# EAGLE design guitar_tuner (EAGLE 9.5.1)
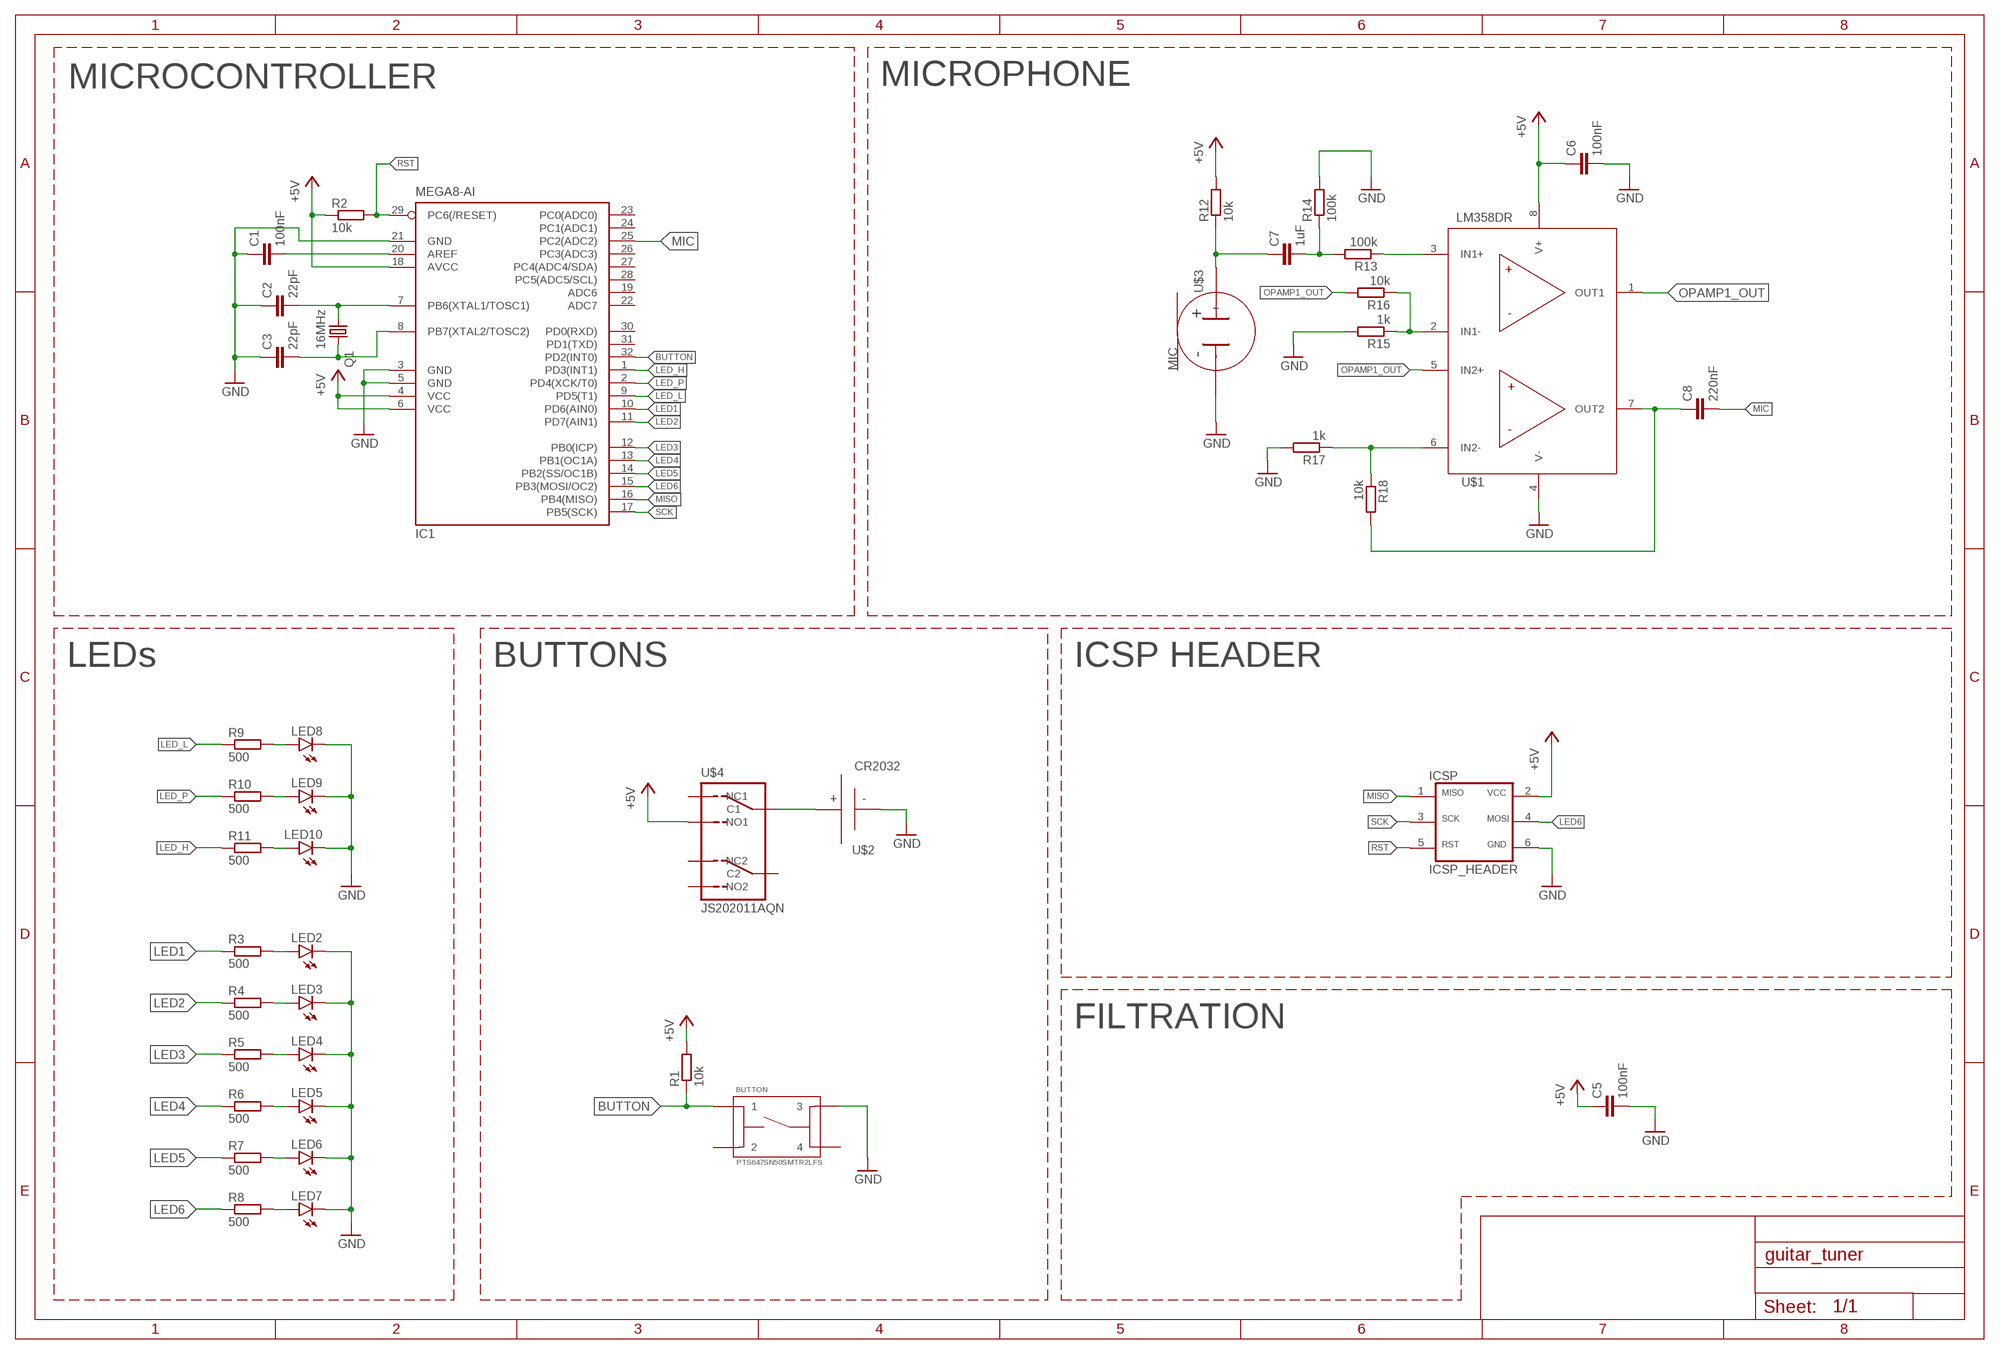
[diagram p0: schematic, sheet 1]

## Parts
BUTTON  PTS647SN50SMTR2LFS  [PTS647_SMD_TACTSWITCH]
C1  100nF  C-EUC0603  [C0603]
C2  22pF  C-EUC0603  [C0603]
C3  22pF  C-EUC0603  [C0603]
C5  100nF  C-EUC0603  [C0603]
C6  100nF  C-EUC0603  [C0603]
C7  1uF  C-EUC0603  [C0603]
C8  220nF  C-EUC0603  [C0603]
IC1  MEGA8-AI  [TQFP32-08]
LED2  LEDCHIPLED_1206  [CHIPLED_1206]
LED3  LEDCHIPLED_1206  [CHIPLED_1206]
LED4  LEDCHIPLED_1206  [CHIPLED_1206]
LED5  LEDCHIPLED_1206  [CHIPLED_1206]
LED6  LEDCHIPLED_1206  [CHIPLED_1206]
LED7  LEDCHIPLED_1206  [CHIPLED_1206]
LED8  LEDCHIPLED_1206  [CHIPLED_1206]
LED9  LEDCHIPLED_1206  [CHIPLED_1206]
LED10  LEDCHIPLED_1206  [CHIPLED_1206]
Q1  16MHz  KX-9B  [5.0X3.2_2]
R1  10k  R-EU_R0603  [R0603]
R2  10k  R-EU_R0603  [R0603]
R3  500  R-EU_R0603  [R0603]
R4  500  R-EU_R0603  [R0603]
R5  500  R-EU_R0603  [R0603]
R6  500  R-EU_R0603  [R0603]
R7  500  R-EU_R0603  [R0603]
R8  500  R-EU_R0603  [R0603]
R9  500  R-EU_R0603  [R0603]
R10  500  R-EU_R0603  [R0603]
R11  500  R-EU_R0603  [R0603]
R12  10k  R-EU_R0603  [R0603]
R13  100k  R-EU_R0603  [R0603]
R14  100k  R-EU_R0603  [R0603]
R15  1k  R-EU_R0603  [R0603]
R16  10k  R-EU_R0603  [R0603]
R17  1k  R-EU_R0603  [R0603]
R18  10k  R-EU_R0603  [R0603]
U$1  LM358DRLM358DR_SOIC8  [SOIC127P599X175-8N]
U$2  BAT-HLD-001-THM  [BAT-HLD-001-THM]
U$3  CMA-6542PF  [9.7MM_ELECTRET_MICROPHONE]
U$4  JS202011AQN  [JS202011AQN_DPDT]
U$6  ICSP_HEADER  [ICSP_HEADER]

## Nets
+5V: C5.1 C6.1 IC1.4(VCC) IC1.6(VCC) IC1.18(AVCC) R1.2 R2.1 R12.2 U$1.8(V+) U$4.P$2(NO1) U$6.2(VCC)
BUTTON: BUTTON.P$1 IC1.32(PD2(INT0)) R1.1
GND: BUTTON.P$2 C1.1 C2.1 C3.1 C5.2 C6.2 IC1.3(GND) IC1.5(GND) IC1.21(GND) LED2.C LED3.C LED4.C LED5.C LED6.C LED7.C LED8.C LED9.C LED10.C R14.2 R15.2 R17.2 U$1.4(V-) U$2.P$6(GND) U$3.P$2(-) U$6.6(GND)
LED1: IC1.10(PD6(AIN0)) R3.1
LED2: IC1.11(PD7(AIN1)) R4.1
LED3: IC1.12(PB0(ICP)) R5.1
LED4: IC1.13(PB1(OC1A)) R6.1
LED5: IC1.14(PB2(SS/OC1B)) R7.1
LED6: IC1.15(PB3(MOSI/OC2)) R8.1 U$6.4(MOSI)
LED_H: IC1.1(PD3(INT1)) R11.1
LED_L: IC1.9(PD5(T1)) R9.1
LED_P: IC1.2(PD4(XCK/T0)) R10.1
MIC: C8.2 IC1.25(PC2(ADC2))
MISO: IC1.16(PB4(MISO)) U$6.1(MISO)
N$1: C2.2 IC1.7(PB6(XTAL1/TOSC1)) Q1.1
N$2: C3.2 IC1.8(PB7(XTAL2/TOSC2)) Q1.2
N$4: C1.2 IC1.20(AREF)
N$5: U$2.P$1(5V) U$2.P$2(5V) U$2.P$3(5V) U$2.P$4(5V) U$2.P$5(5V) U$4.P$3(C1)
N$6: C7.1 R12.1 U$3.P$1(+)
N$7: LED2.A R3.2
N$8: LED3.A R4.2
N$9: LED4.A R5.2
N$10: LED5.A R6.2
N$11: LED6.A R7.2
N$12: LED7.A R8.2
N$13: LED9.A R10.2
N$14: LED8.A R9.2
N$15: LED10.A R11.2
N$16: C7.2 R13.2 R14.1
N$17: R13.1 U$1.3(IN1+)
N$18: R15.1 R16.1 U$1.2(IN1-)
N$19: R17.1 R18.1 U$1.6(IN2-)
N$20: C8.1 R18.2 U$1.7(OUT2)
OPAMP1_OUT: R16.2 U$1.1(OUT1) U$1.5(IN2+)
RST: IC1.29(PC6(/RESET)) R2.2 U$6.5(RST)
SCK: IC1.17(PB5(SCK)) U$6.3(SCK)
Unconnected: BUTTON.P$3 BUTTON.P$4 IC1.19(ADC6) IC1.22(ADC7) IC1.23(PC0(ADC0)) IC1.24(PC1(ADC1)) IC1.26(PC3(ADC3)) IC1.27(PC4(ADC4/SDA)) IC1.28(PC5(ADC5/SCL)) IC1.30(PD0(RXD)) IC1.31(PD1(TXD)) U$4.P$1(NO2) U$4.P$4(C2) U$4.P$5(NC2) U$4.P$6(NC1)

## Notes on the sheet
- MICROCONTROLLER | MICROPHONE
- LEDs | BUTTONS | ICSP HEADER
- FILTRATION

## Library data of the parts
BUTTON = NikodemBartnik:PTS647SN50SMTR2LFS: Tactile Switches 50mA 12VDC, 1.0N 5.0mm H, G leads 4.5x4.5mm
C1-C3 C5-C8 = rcl:C-EU: CAPACITOR, European symbol; SPICEPREFIX: C
IC1 = atmel:MEGA8: MICROCONTROLLER 8 Kbytes FLASH, 1 kbytes SRAM, 512 bytes EEPROM, USART, 6-channel 10 bit ADC, 2-channel 8 bit ADC Pin compatible with Atmega48, ATMega88, ATMega168 Source: avr.lbr; MPN: ATMEGA8-16AU; OC_FARNELL: 9171371; OC_NEWARK: 73M8863
LED2-LED10 = led:LED: LED OSRAM: - CHIPLED LG R971, LG N971, LY N971, LG Q971, LY Q971, LO R971, LY R971 LH N974, LH R974 LS Q976, LO Q976, LY Q976 LO Q996 - Hyper CHIPLED LW Q18S LB Q993, LB Q99A, LB R99A - SideLED LS A670, LO A670, LY A670, LG A670, LP A670 LB A673, LV A673, LT A673, LW A673 LH A674 LY A675 LS A676, LA A676, LO A676, LY A676, LW A676 LS A679, LY A679, LG A679 - Hyper Micro SIDELED® LS Y876, LA Y876, LO Y876, LY Y876 LT Y87S - SmartLED LW L88C, LW L88S LB L89C, LB L89S, LG L890 LS L89K, LO L89K, LY L89K LS L896, LA L896, LO L896, LY L896 - TOPLED LS T670, LO T670, LY T670, LG T670, LP T670 LSG T670, LSP T670, LSY T670, LOP T670, LYG T670 LG T671, LOG T671, LSG T671 LB T673, LV T673, LT T673, LW T673 LH T674 LS T676, LA T676, LO T676, LY T676, LB T676, LH T676, LSB T676, LW T676 LB T67C, LV T67C, LT T67C, LS T67K, LO T67K, LY T67K, LW E67C LS E67B, LA E67B, LO E67B, LY E67B, LB E67C, LV E67C, LT E67C LW T67C LS T679, LY T679, LG T679 LS T770, LO T770, LY T770, LG T770, LP T770 LB T773, LV T773, LT T773, LW T773 LH T774 LS E675, LA E675, LY E675, LS T675 LS T776, LA T776, LO T776, LY T776, LB T776 LHGB T686 LT T68C, LB T68C - Hyper Mini TOPLED® LB M676 - Mini TOPLED Santana® LG M470 LS M47K, LO M47K, LY M47K Source: http://www.osram.convergy.de LUXEON: - LUMILED® LXK2-PW12-R00, LXK2-PW12-S00, LXK2-PW14-U00, LXK2-PW14-V00 LXK2-PM12-R00, LXK2-PM12-S00, LXK2-PM14-U00 LXK2-PE12-Q00, LXK2-PE12-R00, LXK2-PE12-S00, LXK2-PE14-T00, LXK2-PE14-U00 LXK2-PB12-K00, LXK2-PB12-L00, LXK2-PB12-M00, LXK2-PB14-N00, LXK2-PB14-P00, LXK2-PB14-Q00 LXK2-PR12-L00, LXK2-PR12-M00, LXK2-PR14-Q00, LXK2-PR14-R00 LXK2-PD12-Q00, LXK2-PD12-R00, LXK2-PD12-S00 LXK2-PH12-R00, LXK2-PH12-S00 LXK2-PL12-P00, LXK2-PL12-Q00, LXK2-PL12-R00 Source: www.luxeon.com KINGBRIGHT: KA-3528ASYC Source: www.kingbright.com
Q1 = crystal-geyer_V1_0:KX: Quartz Crystals (MHz) SMD: KX - Serie Model Size l/w/h [mm] Frequency Range Frequency Stability Temp. Range [°C] Load Capacitance AECQ 200 availabel Datasheet KX-4 KX-5 KX-6 KX-7 KX-9A KX-9B KX-12A KX-12B KX-13 KX-20 KX-K KX-KS 1.6/1.2/0.3 2.0/1.6/0.45 2.5/2.0/0.55 3.2/2.5/0.8 5.0/3.2/1.0 5.0/3.2/1.1 6.0/3.5/1.1 6.0/3.5/1.0 7.0/5.0 /1.3 11.6/5.5/1.6 12.3/4.5/4.2 12.3/4.5/3.2 24.0 ~ 80.0 MHz 16.0 ~ 80.0 MHz 12.0 ~ 80.0 MHz 8.0 ~ 60.0 MHz 7,68 ~ 300,0 MHz 8,0 ~ 50,0 MHz 8,0 ~ 150,0 MHz 8,0 ~ 50,0 MHz 6,0 ~ 160,0 MHz 3,579 ~ 25,0 MHz 3,579 ~ 70,0 MHz 3,579 ~ 70,0 MHz ±10 … ±50ppm ±10 … ±50ppm ±10 … ±50ppm ±10 … ±50ppm ±10 … ±50ppm ±10 … ±50ppm ±10 … ±50ppm ±10 … ±50ppm ±10 … ±50ppm ±50ppm ±10 … ±50ppm ±10 … ±50ppm (*) -40°C …+85°C (*) -40°C …+125°C (*) -40°C …+125°C (*) -40°C …+125°C (*) -40°C …+105°C (*) -40°C …+105°C (*) -40°C …+125°C (*) -40°C …+105°C (*) -40°C …+105°C (*) -40°C …+105°C (*) -40°C …+85°C (*) -40°C …+85°C 8, 8…16 8, 8…16 10, 8…16 12, 7…20 16, 10…20 16, 10…20 16, 10…20 16, 12…20 16, 12…20 16, 12…20 16, 12…30 16, 12…30 - yes yes yes - - - - - - - - KX-4.pdf <http://www.geyer-electronic.de/uploads/tx_userartikelfrequenz/GEYER-KX-4.pdf> KX-5.pdf <http://www.geyer-electronic.de/uploads/tx_userartikelfrequenz/GEYER-KX-5.pdf> KX-6.pdf <http://www.geyer-electronic.de/uploads/tx_userartikelfrequenz/GEYER-KX-6.pdf> KX-7.pdf <http://www.geyer-electronic.de/uploads/tx_userartikelfrequenz/GEYER-KX-7.pdf> KX-9A.pdf <http://www.geyer-electronic.de/uploads/tx_userartikelfrequenz/GEYER-KX-9A.pdf> KX-9B.pdf <http://www.geyer-electronic.de/uploads/tx_userartikelfrequenz/GEYER-KX-9B.pdf> KX-12A.pdf <http://www.geyer-electronic.de/uploads/tx_userartikelfrequenz/GEYER-KX-12A.pdf> KX-12B.pdf <http://www.geyer-electronic.de/uploads/tx_userartikelfrequenz/GEYER-KX-12B.pdf> KX-13.pdf <http://www.geyer-electronic.de/uploads/tx_userartikelfrequenz/GEYER-KX-13.pdf> KX-20.pdf <http://www.geyer-electronic.de/uploads/tx_userartikelfrequenz/GEYER-KX-20.pdf> KX-K.pdf <http://www.geyer-electronic.de/uploads/tx_userartikelfrequenz/GEYER-KX-K.pdf> KX-KS.pdf <http://www.geyer-electronic.de/uploads/tx_userartikelfrequenz/GEYER-KX-KS.pdf> <http://www.geyer-electronic.de/fileadmin/template/img/logo-geyer-electronic.png> Details see: http://www.geyer-electronic.de/Frequenz-Produkte.9.0.html Created 2016-06-07, Hans Locher 2016 (C) Geyer Quartz Technology KX4,KX5,KX6,KX7,KX9A,KX9B,KX12A,KX12B,KX13,KX20,KXK,KXKS;1612;2016;2520;3225;5032;6035;7050;11655;12345;1,6x1,2;2,0x1,6;2,5x2,0;3,2x2,5;5,0x3,2;6,0x3,5;7,0x5,0;11,6x5,5;12,3x4,5;12,3x4,5;1.6x1.2;2.0x1.6;2.5x2.0;3.2x2.5;5.0x3.2;6.0x3.5;7.0x5.0;11.6x5.5;12.3x4.5;12.3x4.5;
R1-R18 = rcl:R-EU_: RESISTOR, European symbol; SPICEPREFIX: R
U$1 = NikodemBartnik:LM358DR
U$2 = NikodemBartnik:BAT-HLD-001-THM: Coin Cell Battery Holders Bat Hld CR2032/2025 Through-hole Mount
U$3 = NikodemBartnik:CMA-6542PF: Electret microphone CMA-6542PF 4.5V 500uA -42db 2.2Ohm 9.7mm x 6.5mm
U$4 = NikodemBartnik:JS202011AQN: Slide Switches DPDT THRU HOLE .3A R/A ON- ON 300mA 6VDC Angle
U$6 = NikodemBartnik:ICSP_HEADER

## Board
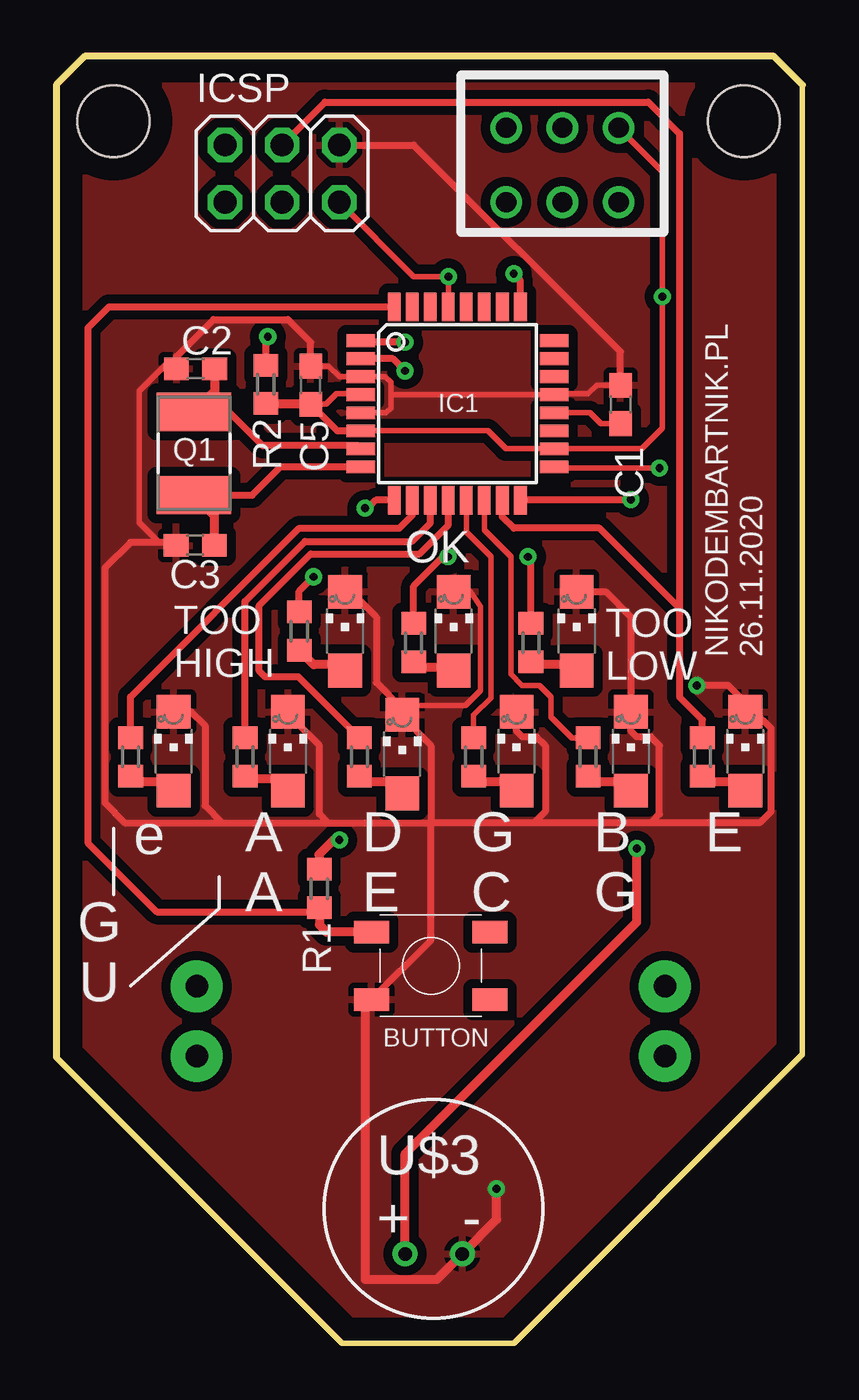
[diagram p1: board, top side]
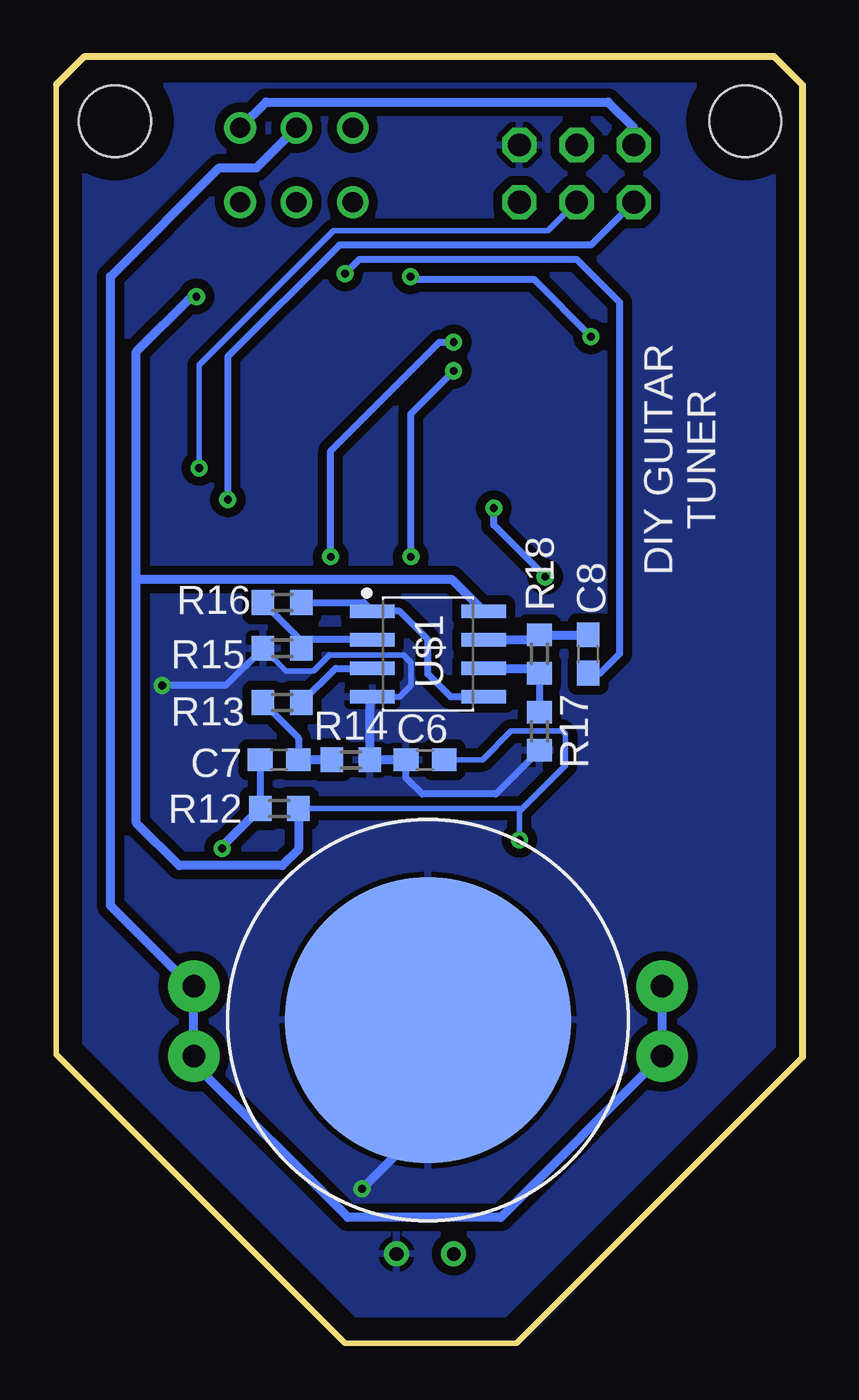
[diagram p2: board, bottom side, seen from below]

Size 33.15 x 57.15 mm. Coordinates in mm from the lower left corner, seen from the top.
Outline: 0,55.88 0,12.7 12.7,0 20.32,0 33.15,12.83 33.15,55.88 31.88,57.15 1.27,57.15 0,55.88
Copper layers (1*16): Top 0.035mm / dielectric 1.5mm / Bottom 0.035mm
Design rules "default": minimum track width 6mil, minimum drill 0.35mm, track to track 6mil, track to pad 6mil, pad to pad 6mil, via to via 6mil, smd to smd 6mil, copper to edge 40mil, drill to drill 6mil, minimum pad ring 10mil, minimum via ring 8mil, stop-mask expansion 4mil, vias tented up to drill 0mil, thermal gap 10mil
Holes 3.2 mm at 30.54,54.27 2.54,54.27

### Footprints (pad centres in the part's own frame; a part is rotated, then mirrored left to right if it is on the bottom)
PTS647_SMD_TACTSWITCH = smd 1.55 x 1: P$1 -2.625,1.5; P$2 -2.625,-1.5; P$3 2.625,1.5; P$4 2.625,-1.5
C0603 = smd 1.1 x 1: 1 -0.85,0; 2 0.85,0
TQFP32-08 = smd 1.27 x 0.559: 1 -4.293,2.8; 2 -4.293,2; 3 -4.293,1.2; 4 -4.293,0.4; 5 -4.293,-0.4; 6 -4.293,-1.2; 7 -4.293,-2; 8 -4.293,-2.8; 17 4.293,-2.8; 18 4.293,-2; 19 4.293,-1.2; 20 4.293,-0.4; 21 4.293,0.4; 22 4.293,1.2; 23 4.293,2; 24 4.293,2.8 | smd 0.559 x 1.27: 9 -2.8,-4.293; 10 -2,-4.293; 11 -1.2,-4.293; 12 -0.4,-4.293; 13 0.4,-4.293; 14 1.2,-4.293; 15 2,-4.293; 16 2.8,-4.293; 25 2.8,4.293; 26 2,4.293; 27 1.2,4.293; 28 0.4,4.293; 29 -0.4,4.293; 30 -1.2,4.293; 31 -2,4.293; 32 -2.8,4.293
CHIPLED_1206 = smd 1.5 x 1.5: A 0,-1.75; C 0,1.75
5.0X3.2_2 = smd 1.7 x 3.3: 1 -1.85,0; 2 1.85,0
R0603 = smd 1 x 1.1: 1 -0.85,0; 2 0.85,0
SOIC127P599X175-8N = smd 1.967 x 0.599: 1 -2.469,1.905; 2 -2.469,0.635; 3 -2.469,-0.635; 4 -2.469,-1.905; 5 2.469,-1.905; 6 2.469,-0.635; 7 2.469,0.635; 8 2.469,1.905
BAT-HLD-001-THM = drill 1 pad 2.3: P$1 10.4,1.5; P$2 10.4,1.5; P$3 10.4,-1.6; P$4 -10.4,1.5; P$5 -10.4,-1.6 | smd 12.7 x 12.7: P$6 0,0
9.7MM_ELECTRET_MICROPHONE = drill 0.6 pad 1: P$1 -1.27,-2; P$2 1.27,-2
JS202011AQN_DPDT = drill 0.9: P$1 2.5,-1.65; P$2 2.5,1.65; P$3 0,1.65; P$4 0,-1.65; P$5 -2.5,-1.65; P$6 -2.5,1.65
ICSP_HEADER = drill 1.016 octagon: 1 -2.54,-1.27; 2 -2.54,1.27; 3 0,-1.27; 4 0,1.27; 5 2.54,-1.27; 6 2.54,1.27

### Placement (x,y rotation side)
BUTTON  16.64,16.76 0 top
C1  25.06,41.69 270 top
C2  6.19,43.27 0 top
C3  6.17,35.43 0 top
C5  11.3,42.54 90 top
C6  16.76,25.91 180 bottom
C7  23.24,25.91 0 bottom
C8  9.53,30.61 270 bottom
IC1  17.82,41.72 0 top
LED2  5.21,26.29 0 top
LED3  10.29,26.29 0 top
LED4  15.37,26.16 0 top
LED5  20.45,26.29 0 top
LED6  25.53,26.29 0 top
LED7  30.61,26.29 0 top
LED8  12.83,31.62 0 top
LED9  17.65,31.62 0 top
LED10  23.11,31.62 0 top
Q1  6.12,39.51 270 top
R1  11.68,20.19 90 top
R2  9.31,42.58 90 top
R3  3.3,26.04 270 top
R4  8.38,26.04 270 top
R5  13.46,26.04 270 top
R6  18.54,26.04 270 top
R7  23.62,26.04 270 top
R8  28.7,26.04 270 top
R9  10.79,31.62 270 top
R10  15.88,31.11 270 top
R11  21.08,31.11 270 top
R12  23.24,23.75 0 bottom
R13  23.11,28.45 180 bottom
R14  20.07,25.91 0 bottom
R15  23.11,30.86 180 bottom
R16  23.11,32.89 0 bottom
R17  11.68,27.18 270 bottom
R18  11.68,30.61 90 bottom
U$1  16.64,30.61 0 bottom
U$2  16.64,14.35 0 bottom
U$3  16.76,5.97 0 top
U$4  22.48,52.32 0 top
U$6  10.03,51.94 0 top

### Tracks (layer width: path | path; a pad name or v marks a point on that pad's centre or on a via)
+5V  (via drill 0.35)
  Top 0.254: C5.1 11.98,41.7 12.45,42.16 13.48,42.16 IC1.4 | R2.1 9.35,41.7 | IC1.6 19.17,40.52 19.97,39.72 IC1.18 26.01,39.72 26.92,40.64 v26.92,46.48 26.92,52.03 U$4.P$2
  Top 0.305: C5.1 12.47,40.52 IC1.6
  Top 0.406: C5.1 9.35,41.7 | R1.2 11.66,21.06 11.66,21.7 12.32,22.35 v12.57,22.35
  Bottom 0.254: C6.1 14.22,25.91 12.95,27.18 10.67,27.18 10.54,27.05 10.54,25.65 12.45,23.75 | 12.45,23.75 12.57,23.62 v12.57,22.35 | 12.45,23.75 R12.2
  Bottom 0.406: U$6.2 7.49,53.97 8.64,55.12 23.84,55.12 U$4.P$2 | R12.2 22.39,21.93 23.11,21.21 27.69,21.21 29.59,23.11 29.59,33.91 | 29.59,33.91 29.59,44.03 27.14,46.48 v26.92,46.48 | U$1.8 15.56,33.91 29.59,33.91
BUTTON
  Top 0.254: 11.37,19.15 11.56,19.34 R1.1
  Top 0.305: IC1.32 2.33,46.02 1.4,45.08 1.4,22.23 4.47,19.15 11.37,19.15
  Top 0.406: BUTTON.P$1 12,18.26 11.68,18.58 R1.1
GND  (via drill 0.35)
  Top 0.254: C5.2 12.1,43.39 12.57,42.92 IC1.3 14.61,42.92 14.86,42.67 14.86,42.16 | C1.1 24,42.54 23.62,42.16 22.15,42.16 IC1.21 14.9,42.12 14.86,42.16 | 14.86,42.16 14.86,41.53 14.65,41.32 IC1.5 | C3.1 5.19,35.56 4.57,35.56 3.68,36.45 3.68,42.29 4.83,43.43 5.17,43.43 C2.1 | LED9.C 18.41,33.37 18.85,32.72 18.85,28.99 18.18,28.32 15.78,28.32
  Top 0.305: LED8.C 13.1,33.37 14.22,32.25 14.22,29.34 15.37,28.19 LED4.C | 7.37,23.11 6.6,23.88 6.6,27.43 6,28.04 LED2.C | LED3.C 10.73,27.49 11.68,26.54 11.68,23.5 12.06,23.11 | 7.37,23.11 12.06,23.11 | LED4.C 15.37,27.86 16.64,26.54 16.64,23.11 | 21.21,23.11 21.72,23.62 21.72,26.54 21.34,26.92 20.7,26.92 20.45,27.18 LED5.C | 21.21,23.11 16.64,23.11 | 26.42,23.11 26.8,23.5 26.8,26.54 26.42,26.92 25.78,26.92 25.53,27.18 LED6.C 25.53,32.26 24.41,33.37 LED10.C | 26.42,23.11 21.21,23.11 | 26.42,23.11 31.24,23.11 31.75,23.62 31.75,27.3 31.02,28.04 LED7.C 30.61,28.45 29.84,29.21 v28.45,29.21 | LED4.C 15.78,28.32 | C2.1 5.34,43.82 6.99,45.47 10.29,45.47 11.3,44.45 C5.2 | C1.1 25.06,44.02 15.88,53.21 U$6.6 | BUTTON.P$2 16.64,17.89 16.64,23.11 | 5.19,35.56 3.3,35.56 2.16,34.42 2.16,24 3.05,23.11 7.37,23.11 | 12.06,23.11 16.64,23.11
  Top 0.406: BUTTON.P$2 13.72,14.97 13.72,2.83 16.89,2.83 U$3.P$2 19.56,5.49 v19.56,6.86
  Bottom 0.254: R15.2 22.95,29.84 21.72,29.84 21.01,30.55 17.72,30.55 17.4,30.23 17.4,29.21 17.91,28.7 U$1.4
  Bottom 0.305: 19.22,28.59 U$1.4 | R17.2 13.63,24.38 16.89,24.38 17.61,25.11 C6.2 | R15.2 25.61,29.21 v28.45,29.21 | 16.64,9.78 U$2.P$6
  Bottom 0.406: 19.22,28.59 R14.2 C6.2 | v19.56,6.86 16.64,9.78
  pour Top (isolate 0.406): 0,55.88 0,12.32 12.32,0 20.57,0 33.02,12.45 33.02,55.88 31.75,57.15 1.27,57.15
  pour Bottom (isolate 0.406): 0,55.88 0,12.45 12.45,0 20.45,0 33.02,12.57 33.02,55.88 31.75,57.15 1.27,57.15
LED1
  Top 0.305: R3.1 3.3,28.7 10.79,36.2 15.24,36.2 15.82,36.77 IC1.10
LED2
  Top 0.305: R4.1 8.38,32.94 11.05,35.61 15.8,35.61 16.62,36.43 IC1.11
LED3
  Top 0.305: R5.1 10.76,29.59 9.27,29.59 9.02,29.84 9.02,32.77 11.3,35.05 16.13,35.05 17.42,36.34 IC1.12
LED4
  Top 0.254: R6.1 18.54,27.9 19.3,28.66 19.3,34.92 18.22,36.01 IC1.13
LED5
  Top 0.254: IC1.14 19.02,36.1 20.19,34.92 20.19,29.71 20.69,29.21 21.46,29.21 21.97,28.7 21.97,27.81 22.9,26.89 R7.1
LED6
  Top 0.305: R8.1 28.7,27.69 27.69,28.7 27.69,32.64 | IC1.15 19.82,36.7 20.32,36.2 24.13,36.2 27.69,32.64 | U$6.4 11.94,55.12 26.29,55.12 27.69,53.72 27.69,32.64
LED_H  (via drill 0.35)
  Top 0.305: R11.1 21.08,34.8 v20.95,34.92 | v15.49,44.45 13.6,44.45 IC1.1
  Bottom 0.305: v20.95,34.92 20.95,39.62 16.13,44.45 v15.49,44.45
LED_L  (via drill 0.35)
  Top 0.305: R9.1 10.79,33.4 v11.43,34.04 | IC1.9 14.19,37.43 13.84,37.08 v13.72,37.08
  Bottom 0.305: v11.43,34.04 13.72,36.32 v13.72,37.08
LED_P  (via drill 0.35)
  Top 0.305: v17.4,34.92 17.18,34.92 15.88,33.62 R10.1 | v15.49,43.18 14.95,43.72 IC1.2
  Bottom 0.305: v17.4,34.92 17.4,41.27 v15.49,43.18
MIC  (via drill 0.35)
  Top 0.305: IC1.25 20.62,47.2 v20.32,47.5
  Bottom 0.305: v20.32,47.5 19.68,48.13 10.03,48.13 8.13,46.23 8.13,30.61 8.98,29.76 C8.2
MISO  (via drill 0.35)
  Top 0.305: v25.53,37.46 25.49,37.43 IC1.16
  Bottom 0.305: U$6.1 9.4,48.77 20.57,48.77 25.53,43.81 v25.53,37.46
N$1
  Top 0.305: Q1.1 7.66,41.36 9.17,39.85 13.4,39.85 IC1.7
  Top 0.406: C2.2 7.04,42.28 Q1.1
N$2
  Top 0.305: Q1.2 8.71,37.66 9.97,38.92 IC1.8
  Top 0.406: Q1.2 7.02,36.76 C3.2
N$4
  Top 0.254: IC1.20 23.7,41.32 24.19,40.84 C1.2
N$5
  Bottom 0.406: U$2.P$2 U$2.P$3 13.4,5.59 20.19,5.59 27.04,12.43 U$2.P$5 U$2.P$4 27.16,15.85 30.73,19.42 30.73,47.37 25.91,52.2 24.26,52.2 U$4.P$3
N$6  (via drill 0.35)
  Top 0.406: U$3.P$1 15.49,8.41 25.78,18.7 v25.78,21.97
  Bottom 0.305: C7.1 R12.1
  Bottom 0.406: v25.78,21.97 25.78,22.06 R12.1
N$7
  Top 0.305: 5.12,24.93 LED2.A
  Top 0.406: 5.12,24.93 3.56,24.93 R3.2
N$8
  Top 0.305: 10.17,25.06 LED3.A
  Top 0.406: R4.2 8.51,25.06 10.17,25.06
N$9
  Top 0.305: 15.25,24.93 LED4.A
  Top 0.406: 15.25,24.93 13.72,24.93 R5.2
N$10
  Top 0.305: 20.36,24.93 LED5.A
  Top 0.406: 20.36,24.93 18.8,24.93 R6.2
N$11
  Top 0.305: 25.44,24.93 LED6.A
  Top 0.406: R7.2 23.88,24.93 25.44,24.93
N$12
  Top 0.305: 30.52,24.93 LED7.A
  Top 0.406: 30.52,24.93 28.96,24.93 R8.2
N$13
  Top 0.305: 17.62,30.01 LED9.A
  Top 0.406: 17.62,30.01 16.13,30.01 R10.2
N$14
  Top 0.305: 12.77,30.14 LED8.A
  Top 0.406: 12.77,30.14 11.43,30.14 R9.2
N$15
  Top 0.305: 23.05,30.14 LED10.A
  Top 0.406: 23.05,30.14 21.21,30.14 R11.2
N$16
  Bottom 0.305: R13.2 22.39,26.88 22.39,26.29 | 22.39,26.29 C7.2 | 22.01,25.91 22.39,26.29
  Bottom 0.406: R14.1 22.01,25.91
N$17
  Bottom 0.305: R13.1 20.74,29.97 U$1.3
N$18
  Bottom 0.305: U$1.2 21.88,31.24 | 21.88,31.24 R15.1 | R16.1 22.31,31.24 21.88,31.24
N$19
  Bottom 0.305: 11.9,29.97 R18.1 R17.1
  Bottom 0.406: U$1.6 11.9,29.97
N$20
  Bottom 0.305: 11.9,31.24 R18.2
  Bottom 0.406: U$1.7 11.9,31.24 | R18.2 C8.1
OPAMP1_OUT
  Bottom 0.305: R16.2 19.49,32.89 U$1.1 17.91,32.51 16.64,31.24 16.64,29.72 15.62,28.7 U$1.5
RST  (via drill 0.35)
  Top 0.254: IC1.29 v17.42,47.37 15.88,47.37 U$6.5
  Top 0.305: v9.4,44.7 9.31,44.61 R2.2
  Bottom 0.305: v9.4,44.7 11.94,47.24 17.29,47.24 v17.42,47.37
SCK  (via drill 0.35)
  Top 0.254: v26.8,38.86 22.17,38.86 IC1.17
  Bottom 0.254: U$6.3 11.3,49.4 20.83,49.4 26.8,43.43 v26.8,38.86

### Text on the board
tPlace: OK | NIKODEMBARTNIK.PL / 26.11.2020 | TOO / HIGH | TOO / LOW
bPlace: DIY GUITAR / TUNER
tNames: e | E | A / A | D / E | G / C | B / G | G / U